# EAGLE design Intar_IR_Module (EAGLE 7.3.0)
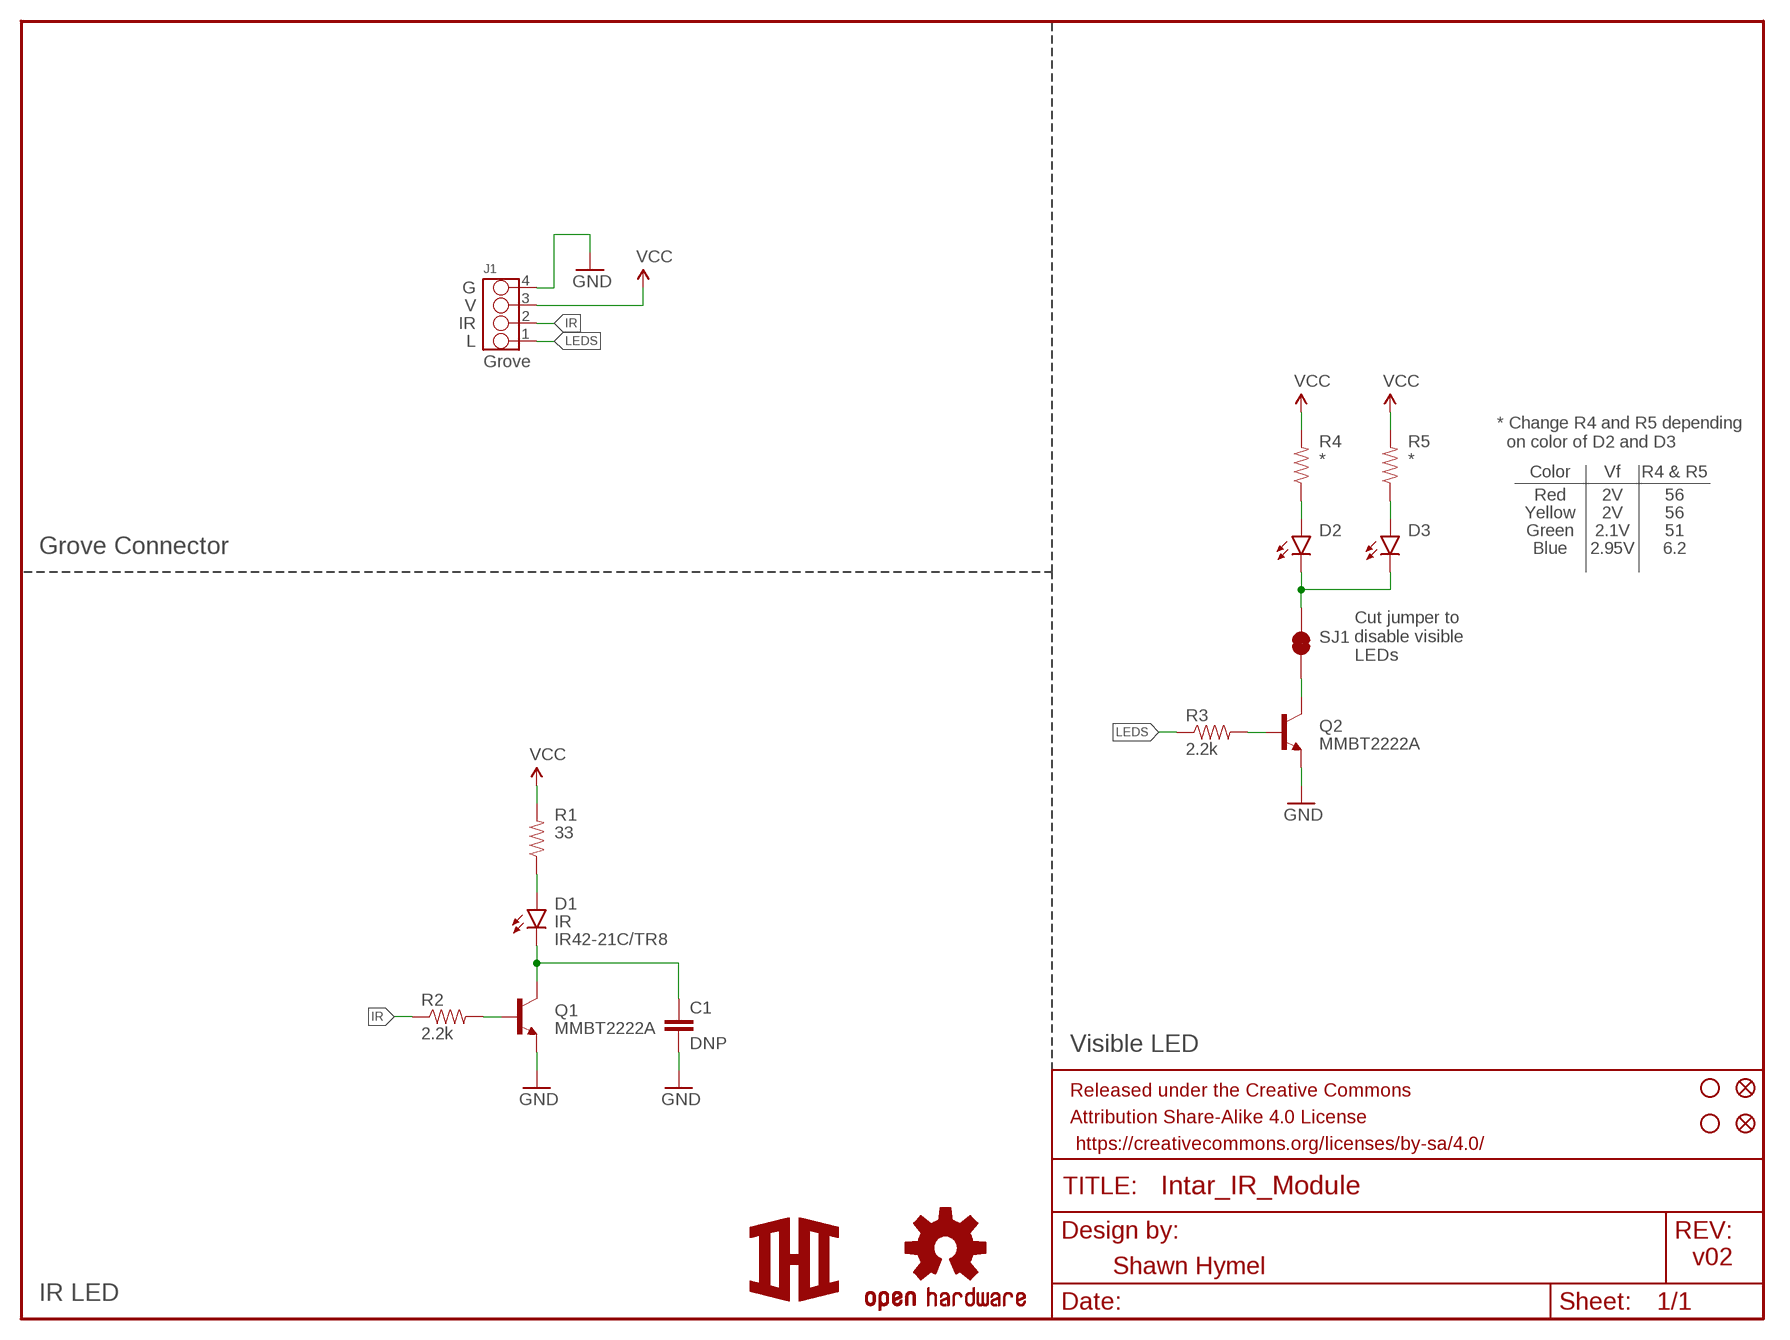
[diagram p0: schematic, sheet 1]

## Parts
C1  DNP  10NF/10000PF-50V-10%(0603)  [0603-CAP]
D1  IR  LEDIR42-21C/TR8  [IR42-21C/TR8]
D2  LED0603  [LED-0603]
D3  LED0603  [LED-0603]
FID1  FIDUCIAL1X2  [FIDUCIAL-1X2]
FID2  FIDUCIAL1X2  [FIDUCIAL-1X2]
FRAME1  FRAME-LETTER  [CREATIVE_COMMONS]
J1  GROVE-4P-2.0-3470130P1  [4P-2.0]
LOGO1  OSHW-LOGOS  [OSHW-LOGO-S]
Q1  MMBT2222A  TRANSISTOR_NPNMMBT2222A  [SOT23-3]
Q2  MMBT2222A  TRANSISTOR_NPNMMBT2222A  [SOT23-3]
R1  33  RESISTOR0603-RES  [0603-RES]
R2  2.2k  2.2KOHM-1/10W-1%(0603)  [0603-RES]
R3  2.2k  2.2KOHM-1/10W-1%(0603)  [0603-RES]
R4  *  RESISTOR0603-RES  [0603-RES]
R5  *  RESISTOR0603-RES  [0603-RES]
SJ1  JUMPER-PAD-2-NC_BY_TRACE  [PAD-JUMPER-2-NC_BY_TRACE_YES_SILK]
STANDOFF1  STAND-OFF  [STAND-OFF]
STANDOFF2  STAND-OFF  [STAND-OFF]
U$1  LOGOSM  [LOGO_SM]

## Nets
GND: C1.2 J1.4 Q1.2(E) Q2.2(E)
IR: J1.2 R2.1
LEDS: J1.1 R3.1
N$1: Q1.1(B) R2.2
N$2: D1.A R1.1
N$3: C1.1 D1.C Q1.3(C)
N$4: D2.C D3.C SJ1.2
N$5: Q2.1(B) R3.2
N$6: D2.A R4.1
N$7: D3.A R5.1
N$8: Q2.3(C) SJ1.1
VCC: J1.3 R1.2 R4.2 R5.2

## Notes on the sheet
- G
- V
- IR
- L
- Grove
- * Change R4 and R5 depending
    on color of D2 and D3
- Color | Vf | R4 & R5
- Red | 2V | 56
- Yellow | 2V | 56
- Green | 2.1V | 51
- Grove Connector | Blue | 2.95V | 6.2
- Cut jumper to
  disable visible
  LEDs
- Visible LED
- v02
- Shawn Hymel
- IR LED

## Library data of the parts
C1 = SparkFun-Capacitors:10NF/10000PF-50V-10%(0603): CAP-00867; PROD_ID: CAP-00867; VALUE: 10nF
D1 = Intar_Eagle_Library:LED; MFG_NAME: IR42-21C/TR8
D2 D3 = SparkFun-LED:LED: LEDs Standard schematic elements and footprints for 5mm, 3mm, 1206, and 0603 sized LEDs. 5mm - Spark Fun Electronics SKU : COM-00529 (and others)
FID1 FID2 = SparkFun-Aesthetics:FIDUCIAL: Fiducial Alignment Points Various fiducial points for machine vision alignment.
FRAME1 = SparkFun-Aesthetics:FRAME-LETTER: Schematic Frame Standard 8.5x11 US Letter frame
J1 = Connector:GROVE-4P-2.0
LOGO1 = SparkFun-Aesthetics:OSHW-LOGO: Open Source Hardware Logo This logo indicates the piece of hardware it is found on incorporates a OSHW license and/or adheres to the definition of open source hardware found here: http://freedomdefined.org/OSHW
Q1 Q2 = SparkFun-DiscreteSemi:TRANSISTOR_NPN: Generic NPN BJT MMBT2222A - TRANS-08049 (SOT-23, 1A 40V) MPSA42 - TRANS-09116 (SOT-23, 500mA 300V) MMBT5088LT1G - TRANS-11160 (SOT-23, 50 mA 30V) BC547 - COM-08928 <http://www.sparkfun.com/products/8928> (TO-92 45V 100mA) (1.Collector 2.Base 3.Emitter) 2N3904 - COM-00521 <http://www.sparkfun.com/products/521> (TO-92 40V 200mA) (1.Emitter 2.Base 3.Collector) P2N2222A - COM-12852 <http://www.sparkfun.com/products/12852> (TO-92 40V 600mA) (1.Collector 2.Base 3.Emitter); PROD_ID: TRANS-08049
R1 R4 R5 = SparkFun-Resistors:RESISTOR: Resistor Basic schematic elements and footprints for 0603, 1206, and PTH resistors.
R2 R3 = SparkFun-Resistors:2.2KOHM-1/10W-1%(0603): RES-08272; PROD_ID: RES-08272
SJ1 = SparkFun-Passives:JUMPER-PAD-2-NC_BY_TRACE
STANDOFF1 STANDOFF2 = SparkFun-Electromechanical:STAND-OFF: #4 Stand Off This is the mechanical footprint for a #4 phillips button head screw. Use the keepout ring to avoid running the screw head into surrounding components. SKU : PRT-00447
U$1 = Intar_Eagle_Library:LOGO

## Board
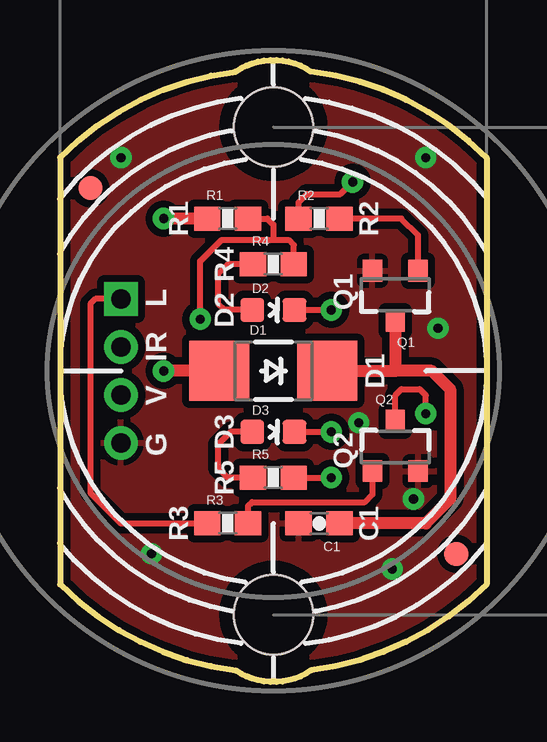
[diagram p1: board, top side]
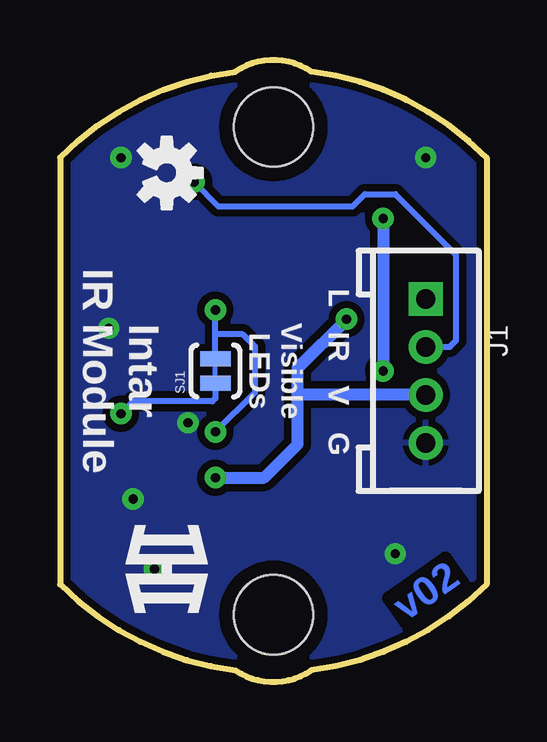
[diagram p2: board, bottom side, seen from below]

Size 17.78 x 25.91 mm. Coordinates in mm from the lower left corner, seen from the top.
Outline: 17.78,21.85 17.78,4.07 arc-38 10.46,0.48 arc-69 7.32,0.48 arc-38 0,4.07 0,21.85 arc-38 7.32,25.43 arc-69 10.46,25.43 arc-38 17.78,21.85
Copper layers (1*16): Top 0.035mm / dielectric 1.5mm / Bottom 0.035mm
Design rules "SparkFun-2-layer": minimum track width 7mil, minimum drill 15mil, track to track 8mil, track to pad 8mil, pad to pad 8mil, via to via 8mil, smd to smd 8mil, copper to edge 8mil, drill to drill 8mil, minimum pad ring 12mil, minimum via ring 10mil, stop-mask expansion 4mil, vias tented up to drill 20mil, thermal gap 10mil

### Footprints (pad centres in the part's own frame; a part is rotated, then mirrored left to right if it is on the bottom)
0603-CAP = smd 1.1 x 1: 1 -0.85,0; 2 0.85,0
IR42-21C/TR8 = smd 2.5 x 2.5: A 0,-2.25; C 0,2.25
LED-0603 = smd 1 x 1: A 0,-0.877; C 0,0.877
FIDUCIAL-1X2 = smd 1 x 1: 1 0,0
4P-2.0 = drill 0.8 pad 1.27 square: 1 -3,0 | drill 0.8 pad 1.27: 2 -1,0; 3 1,0; 4 3,0
SOT23-3 = smd 0.8 x 0.9: 1 -0.95,-1; 2 0.95,-1; 3 0,1.1
0603-RES = smd 1.1 x 1: 1 -0.85,0; 2 0.85,0
PAD-JUMPER-2-NC_BY_TRACE_YES_SILK = smd 0.635 x 1.27: 1 -0.508,0; 2 0.508,0
STAND-OFF = hole 3.302: 0,0

### Placement (x,y rotation side)
C1  10.79,6.61 180 top
D1  8.89,12.96 270 top
D2  8.89,15.5 270 top
D3  8.89,10.42 270 top
FID1  1.27,20.58 270 top
FID2  16.51,5.34 270 top
FRAME1  -24.13,-9.9 0 top  (outside the outline)
J1  2.54,12.96 270 bottom
LOGO1  13.34,21.21 270 bottom
Q1  13.97,16.13 180 top
Q2  13.97,9.78 0 top
R1  6.99,19.31 0 top
R2  10.79,19.31 0 top
R3  6.99,6.61 0 top
R4  8.89,17.4 0 top
R5  8.89,8.51 0 top
SJ1  11.3,12.96 90 bottom
STANDOFF1  8.89,2.8 0 top
STANDOFF2  8.89,23.12 0 top
U$1  13.34,4.7 270 bottom

### Tracks (layer width: path | path; a pad name or v marks a point on that pad's centre or on a via)
GND  (via drill 0.38)
  other vias: 14.73,7.62 12.45,10.8 13.84,4.7 3.81,5.34 2.54,21.85 15.24,21.85 15.75,14.73
  pour Top (isolate 0.305): 0,26.93 17.78,26.93 17.78,-1.01 0,-1.01
  pour Bottom (isolate 0.305): 0,26.93 17.78,26.93 17.78,-1.01 0,-1.01
IR  (via drill 0.38)
  Top 0.254: R2.1 9.95,19.98 10.29,20.32 11.68,20.32 v12.19,20.83
  Bottom 0.254: v12.19,20.83 11.18,19.81 5.59,19.81 5.08,20.32 3.81,20.32 1.27,17.78 1.27,14.23 1.54,13.96 J1.2
LEDS
  Top 0.254: J1.1 1.48,15.96 1.27,15.75 1.27,7.88 2.54,6.61 R3.1
N$1
  Top 0.254: Q1.1 14.92,18.61 14.22,19.31 R2.2
N$2  (via drill 0.38)
  Top 0.508: D1.A v4.32,12.96 | R1.1 v4.32,19.31
  Bottom 0.508: v4.32,19.31 v4.32,12.96
N$3
  Top 0.508: Q1.3 13.97,12.96 | C1.1 15.24,6.61 16.26,7.62 16.26,12.19 15.49,12.96 13.97,12.96 | D1.C 13.97,12.96
N$4  (via drill 0.38)
  Top 0.254: D2.C v11.3,15.5 | D3.C v11.3,10.42
  Bottom 0.254: SJ1.2 11.3,14.48 | 11.3,14.48 v11.3,15.5 | v11.3,10.42 9.65,12.07 9.65,13.97 10.16,14.48 11.3,14.48
N$5
  Top 0.254: Q2.1 13.02,7.81 12.7,7.49 8,7.49 7.84,7.33 R3.2
N$6
  Top 0.254: R4.1 6.99,17.4 6.6,17.02 6.6,15.75 6.86,15.5 D2.A
N$7
  Top 0.254: D3.A 7.11,10.42 6.6,9.91 6.6,8.89 6.99,8.51 R5.1
N$8  (via drill 0.38)
  Top 0.254: Q2.3 13.97,11.94 14.22,12.19 14.99,12.19 15.24,11.94 v15.24,11.18
  Bottom 0.254: SJ1.1 11.3,11.81 11.43,11.69 14.73,11.69 v15.24,11.18
VCC  (via drill 0.38)
  Top 0.254: R4.2 9.74,18.2 9.53,18.42 8.89,18.42 | R5.2 v11.3,8.51 | 8.89,18.42 6.73,18.42 5.84,17.53 v5.84,15.11 | R1.2 8.64,19.31 8.89,19.05 8.89,18.42
  Bottom 0.254: 7.86,11.96 7.87,11.94
  Bottom 0.508: v11.3,8.51 9.27,8.51 7.87,9.91 7.87,11.94 7.87,13.08 v5.84,15.11 | J1.3 7.86,11.96

### Text on the board
Bottom: v02
tPlace: R1 | R2 | R4 | L | D2 | Q1 | IR | D1 | V | G | D3 | Q2 | R5 | R3 | C1
bPlace: L | IR | Visible / LEDs | Intar / IR Module | V | G
tDocu: Shawn Hymel